# EAGLE design br215 (EAGLE 9.4.0)
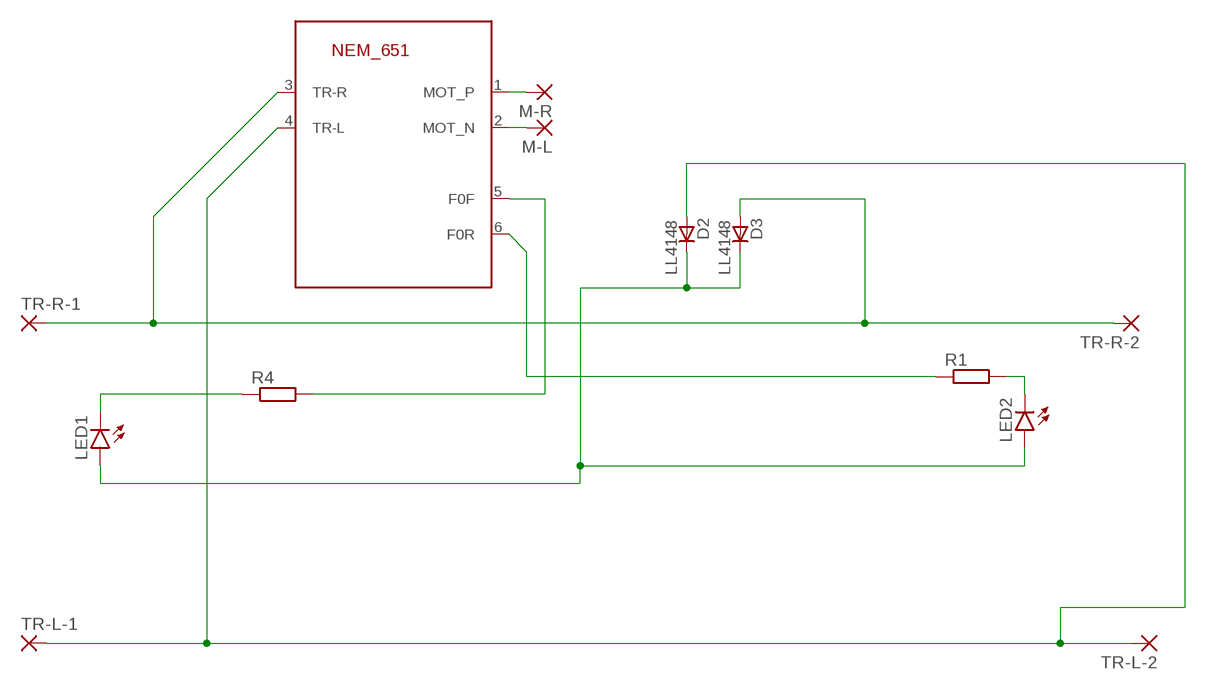
[diagram p0: schematic, sheet 1]

## Parts
651  NEM_651-TS  [53047-06]
D2  LL4148  [SOD80_DO213AA_MINIMELF]
D3  LL4148  [SOD80_DO213AA_MINIMELF]
LED1  LED3MM  [LED3MM]
LED2  LED3MM  [LED3MM]
M-L  SMD5  [SMD2,54-5,08]
M-R  SMD5  [SMD2,54-5,08]
R1  R-EU_R0603  [R0603]
R4  R-EU_R0603  [R0603]
TR-L-1  SMD5  [SMD2,54-5,08]
TR-L-2  SMD5  [SMD2,54-5,08]
TR-R-1  SMD5  [SMD2,54-5,08]
TR-R-2  SMD5  [SMD2,54-5,08]

## Nets
N$1: D2.C D3.C LED1.A LED2.A
N$2: 651.4(TR-L) D2.A TR-L-1.1(P) TR-L-2.1(P)
N$3: 651.3(TR-R) D3.A TR-R-1.1(P) TR-R-2.1(P)
N$4: 651.1(MOT_P) M-R.1(P)
N$5: 651.5(F0F) R4.2
N$6: LED2.K(C) R1.2
N$8: 651.6(F0R) R1.1
N$10: LED1.K(C) R4.1
N$11: 651.2(MOT_N) M-L.1(P)

## Library data of the parts
651 = con-nem:NEM_651: NEM651 Decoder Plug
D2 D3 = _hhn_diodes_smd:LL4148: 1N4148 General Purpose Rectifie SMD-Version of 1N4148 Case: SOD 80 = DO 213 AA = MINIMELF (Glass) Author: Dipl.-Ing. FH Rainer Bayer HHN Hochschule Heilbronn, rainer.bayer@hs-heilbronn.de Ingenieurbüro ing-rb, mail@ing-rb.de
LED1 LED2 = led:LED: LED OSRAM: - CHIPLED LG R971, LG N971, LY N971, LG Q971, LY Q971, LO R971, LY R971 LH N974, LH R974 LS Q976, LO Q976, LY Q976 LO Q996 - Hyper CHIPLED LW Q18S LB Q993, LB Q99A, LB R99A - SideLED LS A670, LO A670, LY A670, LG A670, LP A670 LB A673, LV A673, LT A673, LW A673 LH A674 LY A675 LS A676, LA A676, LO A676, LY A676, LW A676 LS A679, LY A679, LG A679 - Hyper Micro SIDELED® LS Y876, LA Y876, LO Y876, LY Y876 LT Y87S - SmartLED LW L88C, LW L88S LB L89C, LB L89S, LG L890 LS L89K, LO L89K, LY L89K LS L896, LA L896, LO L896, LY L896 - TOPLED LS T670, LO T670, LY T670, LG T670, LP T670 LSG T670, LSP T670, LSY T670, LOP T670, LYG T670 LG T671, LOG T671, LSG T671 LB T673, LV T673, LT T673, LW T673 LH T674 LS T676, LA T676, LO T676, LY T676, LB T676, LH T676, LSB T676, LW T676 LB T67C, LV T67C, LT T67C, LS T67K, LO T67K, LY T67K, LW E67C LS E67B, LA E67B, LO E67B, LY E67B, LB E67C, LV E67C, LT E67C LW T67C LS T679, LY T679, LG T679 LS T770, LO T770, LY T770, LG T770, LP T770 LB T773, LV T773, LT T773, LW T773 LH T774 LS E675, LA E675, LY E675, LS T675 LS T776, LA T776, LO T776, LY T776, LB T776 LHGB T686 LT T68C, LB T68C - Hyper Mini TOPLED® LB M676 - Mini TOPLED Santana® LG M470 LS M47K, LO M47K, LY M47K Source: http://www.osram.convergy.de LUXEON: - LUMILED® LXK2-PW12-R00, LXK2-PW12-S00, LXK2-PW14-U00, LXK2-PW14-V00 LXK2-PM12-R00, LXK2-PM12-S00, LXK2-PM14-U00 LXK2-PE12-Q00, LXK2-PE12-R00, LXK2-PE12-S00, LXK2-PE14-T00, LXK2-PE14-U00 LXK2-PB12-K00, LXK2-PB12-L00, LXK2-PB12-M00, LXK2-PB14-N00, LXK2-PB14-P00, LXK2-PB14-Q00 LXK2-PR12-L00, LXK2-PR12-M00, LXK2-PR14-Q00, LXK2-PR14-R00 LXK2-PD12-Q00, LXK2-PD12-R00, LXK2-PD12-S00 LXK2-PH12-R00, LXK2-PH12-S00 LXK2-PL12-P00, LXK2-PL12-Q00, LXK2-PL12-R00 Source: www.luxeon.com KINGBRIGHT: KA-3528ASYC Source: www.kingbright.com
M-L M-R TR-L-1 TR-L-2 TR-R-1 TR-R-2 = wirepad:SMD5: SMD PAD
R1 R4 = rcl:R-EU_: RESISTOR, European symbol; SPICEPREFIX: R

## Board
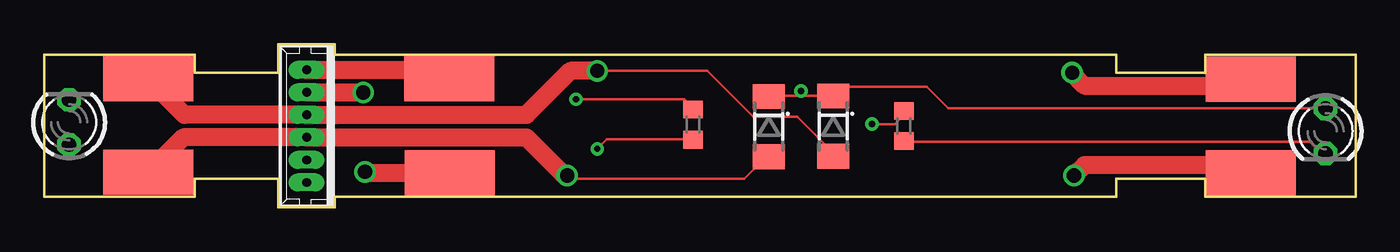
[diagram p1: board, top side]
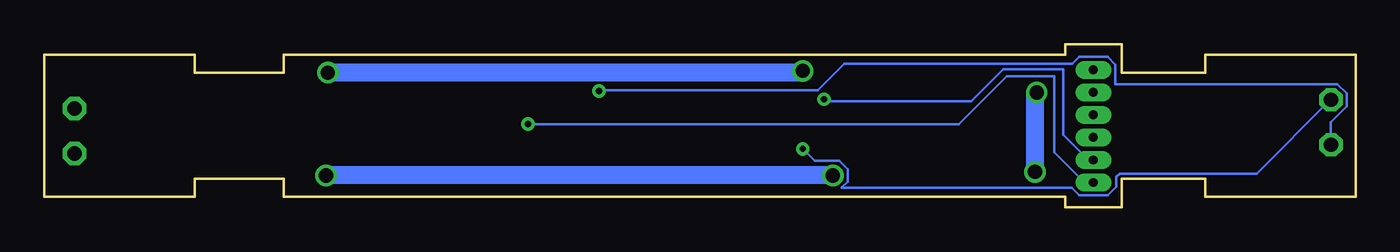
[diagram p2: board, bottom side, seen from below]

Size 74 x 9.2 mm. Coordinates in mm from the lower left corner, seen from the top.
Outline: 0,0.6 0,8.6 8.5,8.6 8.5,7.6 13.2,7.6 13.2,9.2 16.4,9.2 16.4,8.6 60.5,8.6 60.5,7.6 65.5,7.6 65.5,8.6 74,8.6 74,0.6 65.5,0.6 65.5,1.6 60.5,1.6 60.5,0.6 16.4,0.6 16.4,0 13.2,0 13.2,1.6 8.5,1.6 8.5,0.6 0,0.6
Copper layers (1*16): Top 0.035mm / dielectric 1.5mm / Bottom 0.035mm
Design rules "default *": minimum track width 6mil, minimum drill 0.35mm, track to track 6mil, track to pad 6mil, pad to pad 6mil, via to via 6mil, smd to smd 6mil, copper to edge 6mil, drill to drill 6mil, minimum pad ring 10mil, minimum via ring 8mil, stop-mask expansion 4mil, vias tented up to drill 0mil, thermal gap 10mil

### Footprints (pad centres in the part's own frame; a part is rotated, then mirrored left to right if it is on the bottom)
53047-06 = drill 0.5 pad 0.698 long: 1 3.175,0; 2 1.905,0; 3 0.635,0; 4 -0.635,0; 5 -1.905,0; 6 -3.175,0
SOD80_DO213AA_MINIMELF = smd 1.4 x 1.8: A 1.7,0; C -1.7,0
LED3MM = drill 0.813 octagon: A -1.27,0; K 1.27,0
SMD2,54-5,08 = smd 2.54 x 5.08: 1 0,0
R0603 = smd 1 x 1.1: 1 -0.85,0; 2 0.85,0

### Placement (x,y rotation side)
651  14.8,4.58 90 top
D2  40.88,4.56 270 top
D3  44.52,4.58 270 top
LED1  1.4,4.8 90 top
LED2  72.3,4.3 270 top
M-L  22.88,1.94 90 top
M-R  22.86,7.26 90 top
R1  48.5,4.59 270 top
R4  36.6,4.67 90 top
TR-L-1  5.87,1.97 90 top
TR-L-2  68.08,1.96 90 top
TR-R-1  68.07,7.23 90 top
TR-R-2  5.87,7.25 90 top

### Tracks (layer width: path | path; a pad name or v marks a point on that pad's centre or on a via)
N$1  (via drill 0.35)
  Top 0.152: 42.7,6.3 44.5,6.3 D3.C 45,6.6 45.2,6.8 49.8,6.8 51,5.6 72,5.6 LED2.A | D2.C 40.92,6.3 42.7,6.3 | v42.7,6.56 42.7,6.3
  Bottom 0.152: LED1.A 1.4,4.81 0.51,5.7 0.51,6.44 1.03,6.96 13.56,6.96 13.56,8.06 13.99,8.49 15.61,8.49 15.99,8.11 28.85,8.11 30.36,6.6 42.7,6.6 v42.7,6.56
N$2  (via drill 0.8)
  Top 0.152: D2.A 40.5,2.6 39.5,1.6 30,1.6 v29.5,1.8
  Top 1.016: TR-L-1.1 7.84,3.95 651.4 27.2,3.95 29.34,1.8 v29.5,1.8 | v58.1,1.8 58.7,2.4 67.64,2.4 TR-L-2.1
  Top 1.27: TR-L-1.1 7.65,1.97
  Bottom 1.016: v29.5,1.8 v58.1,1.8
N$3  (via drill 0.8)
  Top 0.152: v31.2,7.7 37.4,7.7 40,5.1 42.5,5.1 44.5,3.1 D3.A
  Top 1.016: TR-R-2.1 7.91,5.21 651.3 27.2,5.21 29.68,7.7 v31.2,7.7 | TR-R-1.1 67.7,7.6 66.54,7.6 65.81,6.86 58.7,6.86 58,7.56 v58,7.6
  Top 1.27: TR-R-2.1 7.63,7.25
  Bottom 1.016: v31.2,7.7 31.28,7.62 57.95,7.62 57.97,7.6 v58,7.6
N$4
  Top 1.016: 651.1 22.36,7.75 M-R.1
N$5  (via drill 0.35)
  Top 0.152: v30,6.1 36.12,6.1 36.5,5.62 R4.2
  Bottom 0.152: v30,6.1 29.9,6 21.7,6 19.9,7.8 16.5,7.8 16.5,4.1 15,2.6 651.5
N$6
  Top 0.152: R1.2 48.5,3.7 71.4,3.7 72,3.1 LED2.K
N$8  (via drill 0.35)
  Top 0.152: R1.1 48.5,5.2 48,4.7 v46.7,4.7
  Bottom 0.152: v46.7,4.7 22.4,4.7 19.7,7.4 17,7.4 17,3.1 15,1.1 651.6
N$10  (via drill 0.35)
  Top 0.152: R4.1 36.57,3.85 31.75,3.85 v31.2,3.3
  Bottom 0.152: v31.2,3.3 30.53,2.63 29.16,2.63 28.67,2.15 28.67,1.46 29,1.12 29,1.1 16.04,1.1 15.61,0.67 13.99,0.67 13.51,1.16 13.51,1.73 13.33,1.9 5.59,1.9 1.43,6.07 LED1.K
N$11  (via drill 0.8)
  Top 1.016: v18.1,2 18.16,1.94 M-L.1 | 651.2 v18,6.48
  Bottom 1.016: v18,6.48 18.1,6.38 v18.1,2